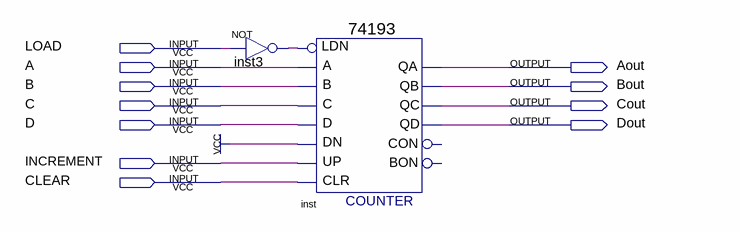
[diagram p0: schematic sheet]
// Quartus schematic Counter.bdf as structural Verilog: 2 symbols, 11 pins
module Counter (
  input  LOAD,
  input  A,
  input  B,
  input  C,
  input  D,
  input  INCREMENT,
  input  CLEAR,
  output Aout,
  output Bout,
  output Cout,
  output Dout
);

  wire inst3_out;

  not inst3 (inst3_out, LOAD);
  \74193  inst (
    .D(D), .C(C), .B(B), .A(A), .CLR(CLEAR), .UP(INCREMENT), .DN(1'b1), .LDN(inst3_out), .QB(Bout),
    .QA(Aout), .QD(Dout), .QC(Cout));  // open: CON, BON
endmodule
